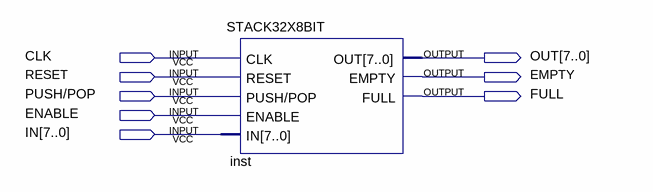
[diagram p0: schematic sheet]
// Quartus schematic Block1.bdf as structural Verilog: 1 symbols, 8 pins
module Block1 (
  input  CLK,
  input  RESET,
  input  \PUSH/POP ,
  input  ENABLE,
  input  [7:0] IN,
  output [7:0] OUT,
  output EMPTY,
  output FULL
);

  STACK32X8BIT inst (
    .CLK(CLK), .RESET(RESET), .\PUSH/POP (\PUSH/POP ), .ENABLE(ENABLE), .IN(IN), .OUT(OUT), .EMPTY(EMPTY),
    .FULL(FULL));
endmodule
